# EAGLE schematic MotorConnector (EAGLE 7.1.0)
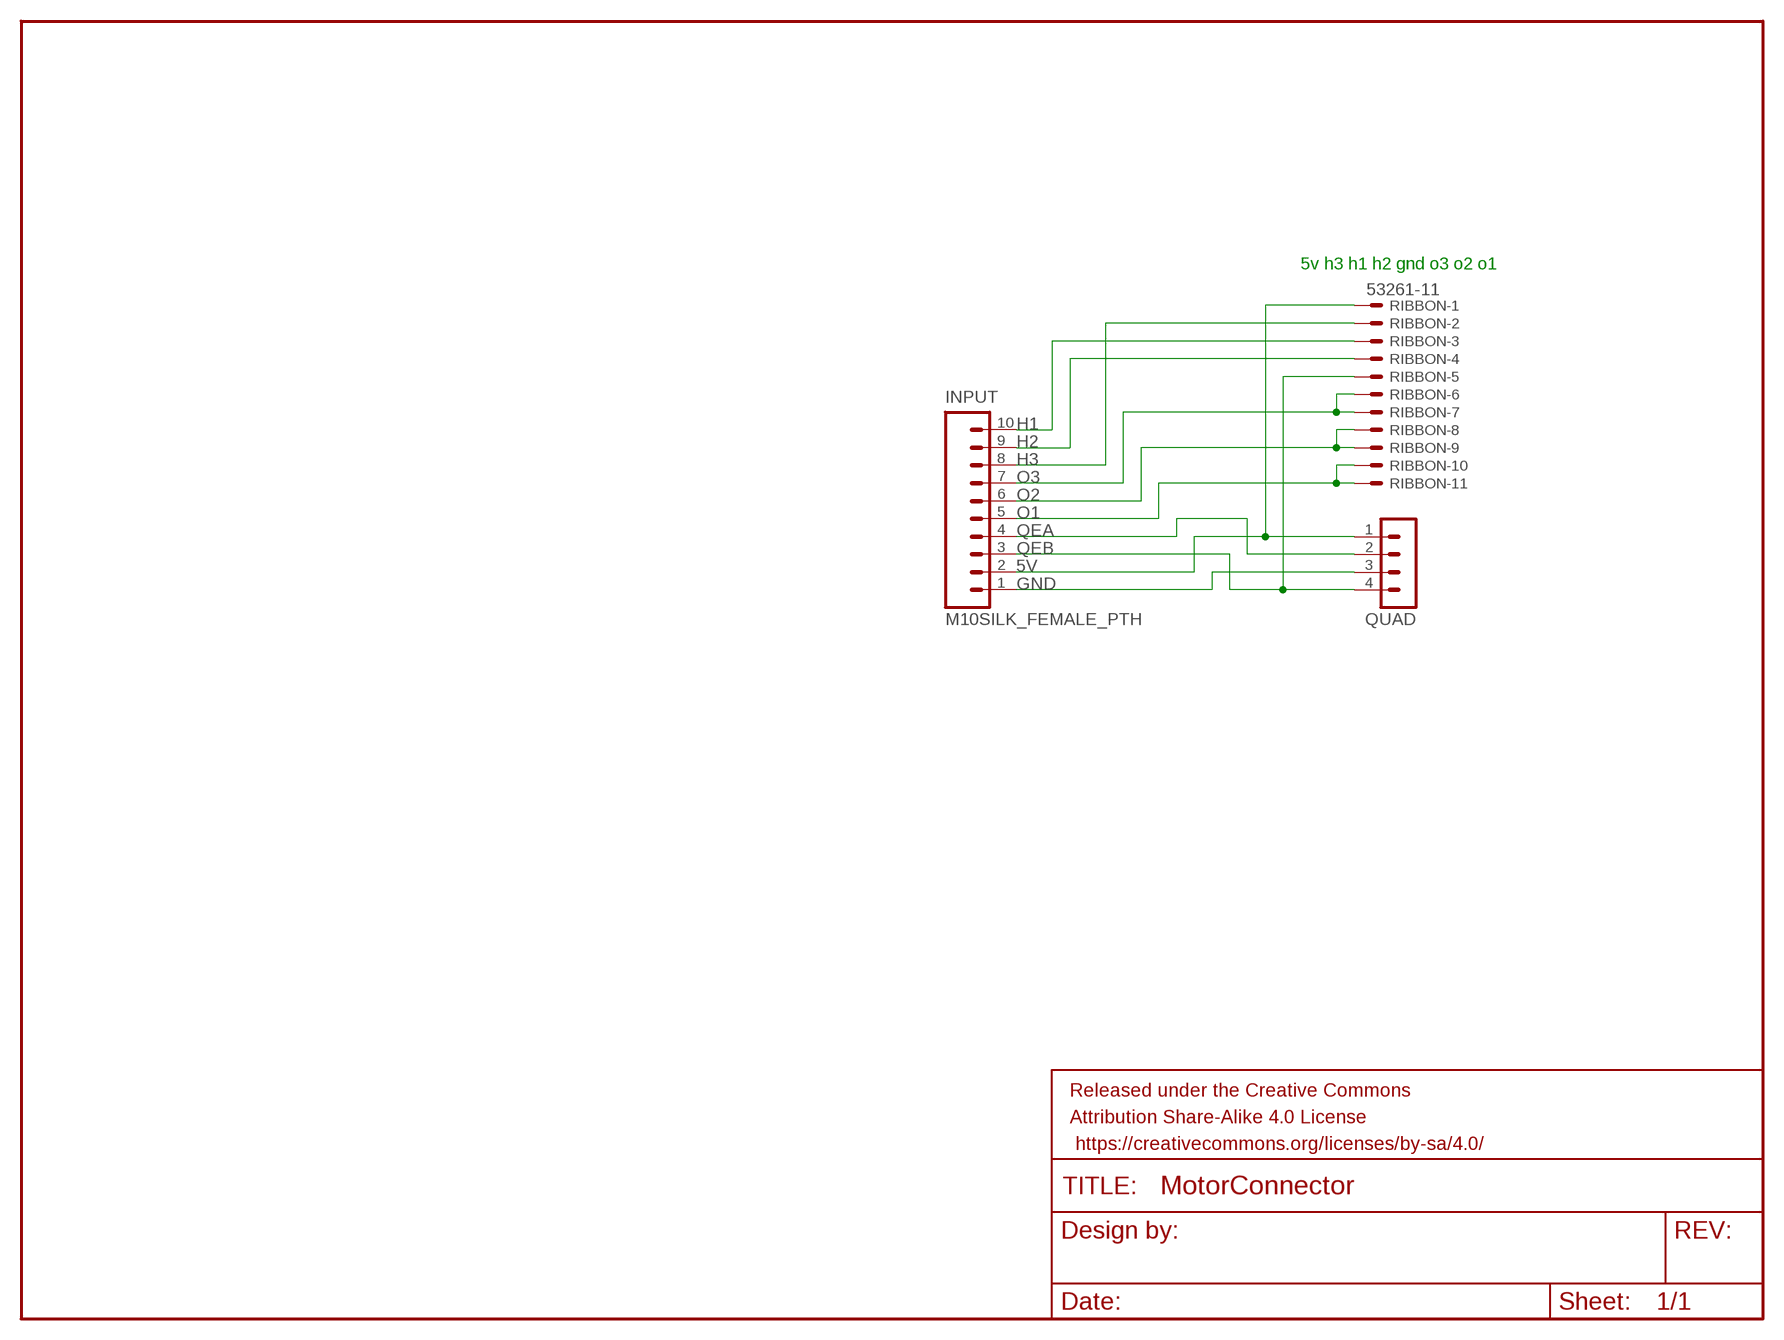
[diagram p0: schematic, sheet 1]

## Parts
FRAME1  FRAME-LETTER  [CREATIVE_COMMONS]
INPUT  M10SILK_FEMALE_PTH  [1X10]
QUAD  MA04-1  [MA04-1]
RIBBON  53261-11  [53261-11]

## Nets
5V: INPUT.2 QUAD.1 RIBBON.1
GND: INPUT.1 QUAD.3
H1: INPUT.10 RIBBON.3
H2: INPUT.9 RIBBON.4
H3: INPUT.8 RIBBON.2
O1: INPUT.5 RIBBON.10 RIBBON.11
O2: INPUT.6 RIBBON.8 RIBBON.9
O3: INPUT.7 RIBBON.6 RIBBON.7
QEA: INPUT.4 QUAD.2
QEB: INPUT.3 QUAD.4 RIBBON.5

## Notes on the sheet
- 5v h3 h1 h2 gnd o3 o2 o1

## Library data of the parts
FRAME1 = SparkFun-Aesthetics:FRAME-LETTER: Schematic Frame Standard 8.5x11 US Letter frame
INPUT = SparkFun-Connectors:M10: Header 10 Standard 10-pin 0.1" header. Use with straight break away headers (SKU : PRT-00116), right angle break away headers (PRT-00553), swiss pins (PRT-00743), machine pins (PRT-00117), and female headers (PRT-00115).; PROD_ID: CONN-11563
QUAD = con-lstb:MA04-1: PIN HEADER; OC_FARNELL: unknown; OC_NEWARK: unknown
RIBBON = con-molex:53?-11: CONNECTOR wire to board 1.25 mm (.049 inch) pitch header; MPN: 53261-1171; OC_FARNELL: 1756926; OC_NEWARK: 58K8238